# EAGLE design trinket-mcp23017 (EAGLE 9.6.2)
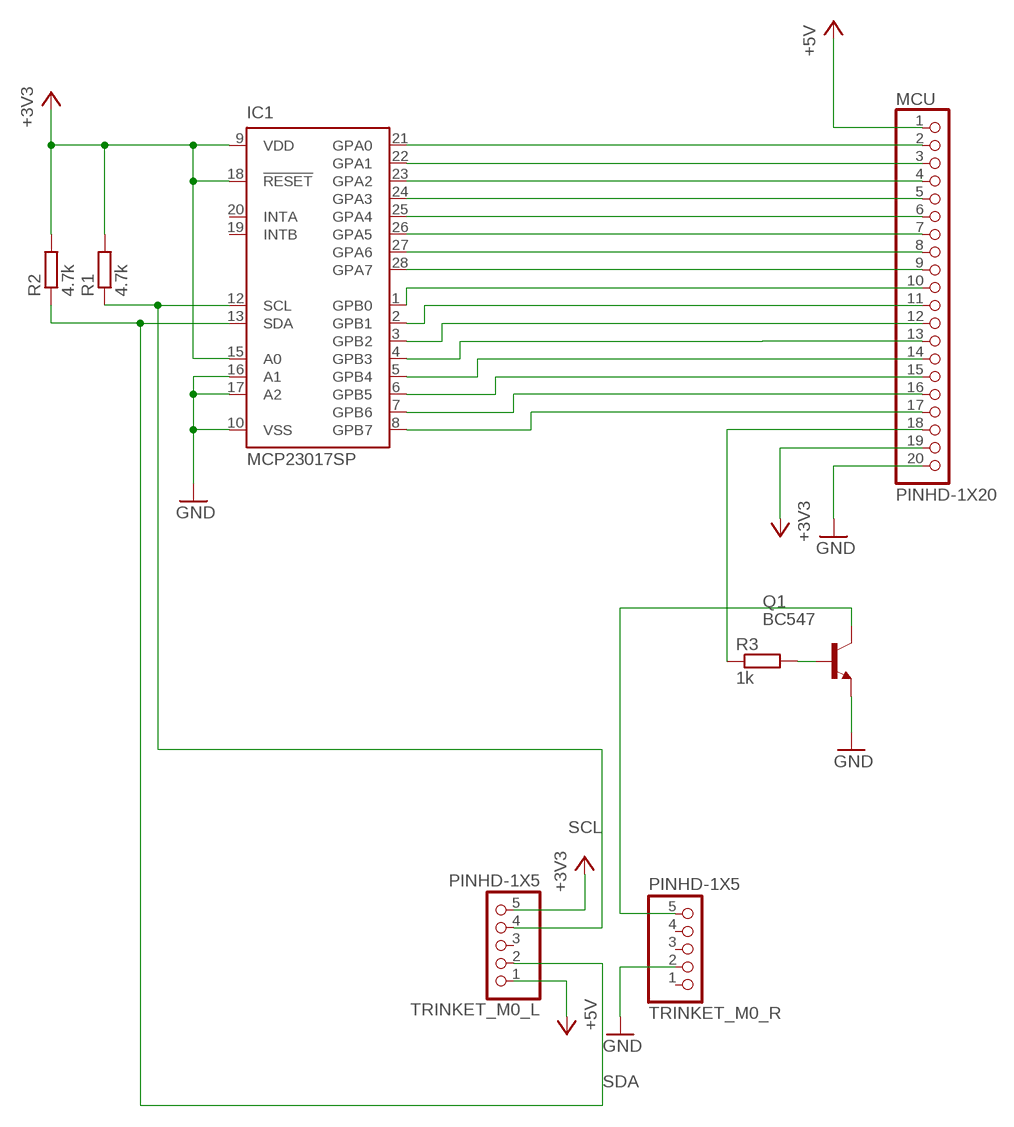
[diagram p0: schematic, sheet 1]

## Parts
IC1  MCP23017SP  [DIL28-3]
MCU  PINHD-1X20  [1X20]
Q1  BC547  [TO92]
R1  4.7k  R-EU_0207/10  [0207/10]
R2  4.7k  R-EU_0207/10  [0207/10]
R3  1k  R-EU_0207/10  [0207/10]
TRINKET_M0_L  PINHD-1X5  [1X05]
TRINKET_M0_R  PINHD-1X5  [1X05]

## Nets
+3V3: IC1.9(VDD) IC1.15(A0) IC1.18(!RESET) MCU.19 R1.2 R2.2 TRINKET_M0_L.5
+5V: MCU.1 TRINKET_M0_L.1
GND: IC1.10(VSS) IC1.16(A1) IC1.17(A2) MCU.20 Q1.1(E) TRINKET_M0_R.2
N$1: IC1.21(GPA0) MCU.2
N$2: IC1.22(GPA1) MCU.3
N$3: IC1.23(GPA2) MCU.4
N$4: IC1.24(GPA3) MCU.5
N$5: IC1.25(GPA4) MCU.6
N$6: IC1.26(GPA5) MCU.7
N$7: IC1.27(GPA6) MCU.8
N$8: IC1.28(GPA7) MCU.9
N$9: IC1.1(GPB0) MCU.10
N$10: IC1.2(GPB1) MCU.11
N$11: IC1.3(GPB2) MCU.12
N$12: IC1.4(GPB3) MCU.13
N$13: IC1.5(GPB4) MCU.14
N$14: IC1.6(GPB5) MCU.15
N$15: IC1.7(GPB6) MCU.16
N$16: IC1.8(GPB7) MCU.17
N$17: Q1.2(B) R3.2
N$18: MCU.18 R3.1
N$19: Q1.3(C) TRINKET_M0_R.5
SCL: IC1.12(SCL) R1.1 TRINKET_M0_L.4
SDA: IC1.13(SDA) R2.1 TRINKET_M0_L.2
Unconnected: IC1.19(INTB) IC1.20(INTA) TRINKET_M0_L.3 TRINKET_M0_R.1 TRINKET_M0_R.3 TRINKET_M0_R.4

## Library data of the parts
IC1 = microchip:MCP23017: http://ww1.microchip.com/downloads/en/DeviceDoc/21952a.pdf Source: http://ww1.microchip.com/downloads/en/DeviceDoc/21952a.pdf; MF: MICROCHIP; MPN: MCP23017-E/SP; OC_FARNELL: 1332088; OC_NEWARK: 31K2959
MCU = Connector:PINHD-1X20: PIN HEADER; CATEGORY: CONNECTOR; SUB-CATEGORY: PIN-HEADER
Q1 = transistor-npn:BC547*: NPN Transistor
R1-R3 = rcl:R-EU_: RESISTOR, European symbol; SPICEPREFIX: R
TRINKET_M0_L TRINKET_M0_R = Connector:PINHD-1X5: PIN HEADER; CATEGORY: CONNECTOR; SUB-CATEGORY: PIN-HEADER

## Board
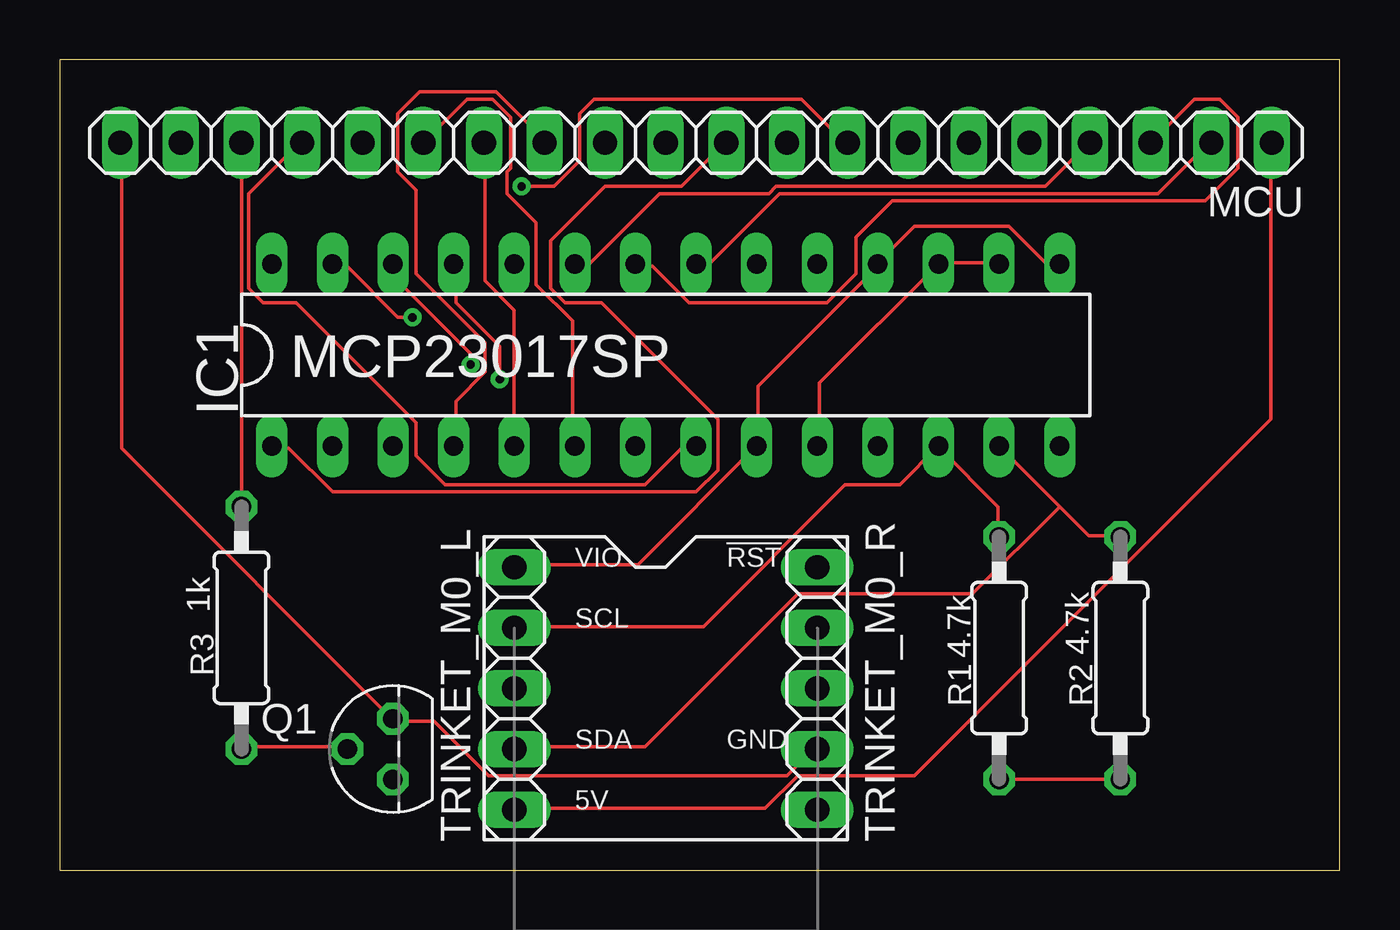
[diagram p1: board, top side]
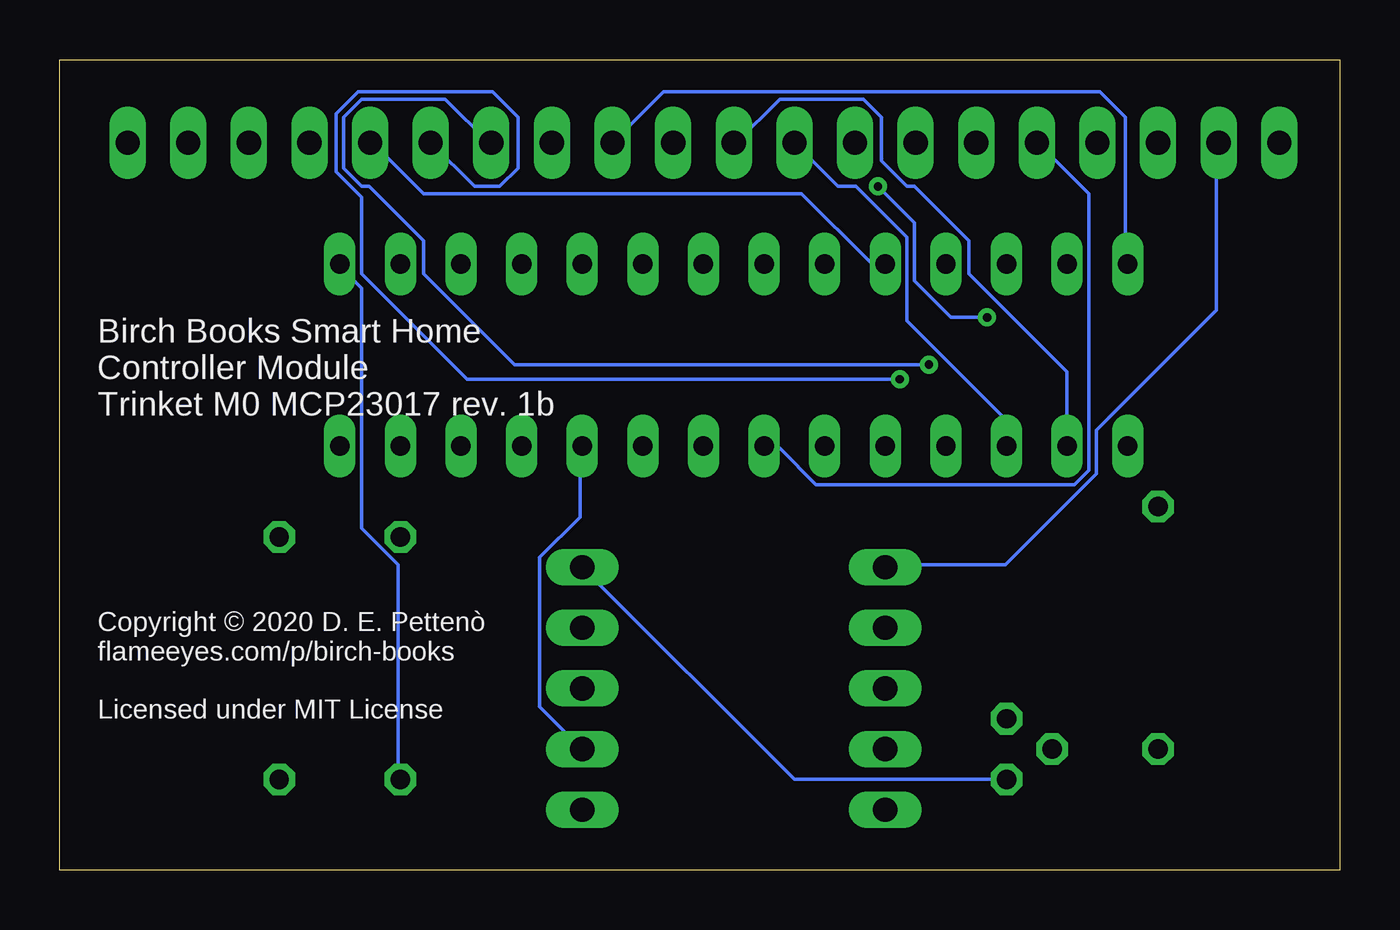
[diagram p2: board, bottom side, seen from below]

Size 53.65 x 33.96 mm. Coordinates in mm from the lower left corner, seen from the top.
Outline: 0,0 53.65,0 53.65,33.96 0,33.96 0,0
Copper layers (1*16): Top 0.035mm / dielectric 1.5mm / Bottom 0.035mm
Design rules "default": minimum track width 6mil, minimum drill 0.35mm, track to track 6mil, track to pad 6mil, pad to pad 6mil, via to via 6mil, smd to smd 6mil, copper to edge 40mil, drill to drill 6mil, minimum pad ring 10mil, minimum via ring 8mil, stop-mask expansion 4mil, vias tented up to drill 0mil, thermal gap 10mil

### Footprints (pad centres in the part's own frame; a part is rotated, then mirrored left to right if it is on the bottom)
DIL28-3 = drill 0.813 long: 1 -16.51,-3.81; 2 -13.97,-3.81; 3 -11.43,-3.81; 4 -8.89,-3.81; 5 -6.35,-3.81; 6 -3.81,-3.81; 7 -1.27,-3.81; 8 1.27,-3.81; 9 3.81,-3.81; 10 6.35,-3.81; 11 8.89,-3.81; 12 11.43,-3.81; 13 13.97,-3.81; 14 16.51,-3.81; 15 16.51,3.81; 16 13.97,3.81; 17 11.43,3.81; 18 8.89,3.81; 19 6.35,3.81; 20 3.81,3.81; 21 1.27,3.81; 22 -1.27,3.81; 23 -3.81,3.81; 24 -6.35,3.81; 25 -8.89,3.81; 26 -11.43,3.81; 27 -13.97,3.81; 28 -16.51,3.81
1X20 = drill 1.016 long: 1 -24.13,0; 2 -21.59,0; 3 -19.05,0; 4 -16.51,0; 5 -13.97,0; 6 -11.43,0; 7 -8.89,0; 8 -6.35,0; 9 -3.81,0; 10 -1.27,0; 11 1.27,0; 12 3.81,0; 13 6.35,0; 14 8.89,0; 15 11.43,0; 16 13.97,0; 17 16.51,0; 18 19.05,0; 19 21.59,0; 20 24.13,0
TO92 = drill 0.813 octagon: 1 1.27,0; 2 0,1.905; 3 -1.27,0
0207/10 = drill 0.813 octagon: 1 -5.08,0; 2 5.08,0
1X05 = drill 1.016 long: 1 -5.08,0; 2 -2.54,0; 3 0,0; 4 2.54,0; 5 5.08,0

### Placement (x,y rotation side)
IC1  25.4,21.59 0 top
MCU  26.67,30.48 180 top
Q1  13.97,5.08 90 top
R1  39.37,8.89 270 top
R2  44.45,8.89 270 top
R3  7.62,10.16 270 top
TRINKET_M0_L  19.05,7.62 90 top
TRINKET_M0_R  31.75,7.62 90 top

### Tracks (layer width: path | path; a pad name or v marks a point on that pad's centre or on a via)
+3V3
  Top 0.152: R2.2 R1.2 | IC1.15 41.91,25.45 41.3,25.45 39.78,26.98 35.81,26.98 34.29,25.45 IC1.18 34.29,25.3 29.26,20.27 29.26,17.83 IC1.9 24.23,12.8 19.05,12.8 TRINKET_M0_L.5
  Bottom 0.152: MCU.19 5.18,30.48 5.18,23.47 10.21,18.44 10.21,16.61 14.02,12.8 19.05,12.8 TRINKET_M0_L.5 | R1.2 39.47,3.81 39.47,12.8 41,14.33 41,24.38 41.91,25.3 IC1.15
+5V
  Top 0.152: TRINKET_M0_L.1 19.05,2.59 29.57,2.59 30.94,3.96 35.81,3.96 50.75,18.9 50.75,30.48 MCU.1
GND
  Top 0.152: IC1.10 31.85,17.83 31.85,20.42 IC1.17 36.88,25.45 39.32,25.45 IC1.16 | TRINKET_M0_R.2 31.7,5.18 30.48,3.96 17.98,3.96 15.7,6.25 14.02,6.25 Q1.1 13.87,6.4 2.59,17.68 2.59,30.48 MCU.20
  Bottom 0.152: TRINKET_M0_R.2 33.53,6.86 33.53,13.11 31.85,14.78 31.85,17.68 IC1.10
N$1
  Top 0.152: IC1.21 26.67,25.45 27.28,25.45 30.18,28.35 46.02,28.35 48.16,30.48 MCU.2
N$2
  Top 0.152: MCU.3 47.55,32.31 48.62,32.31 49.38,31.55 49.38,29.41 48.01,28.04 34.9,28.04 33.38,26.52 33.38,24.99 32.16,23.77 26.36,23.77 24.84,25.3 24.23,25.3 IC1.22
N$3
  Top 0.152: IC1.23 21.64,25.45 22.25,25.45 25.15,28.35 29.72,28.35 30.02,28.65 41.3,28.65 43.13,30.48 MCU.4
N$4
  Bottom 0.152: IC1.24 19.05,25.45 19.66,25.45 22.55,28.35 38.41,28.35 40.54,30.48 MCU.5
N$5  (via drill 0.35)
  Top 0.152: v18.44,20.57 18.44,21.95 16.61,23.77 16.61,25.3 IC1.25
  Bottom 0.152: v18.44,20.57 36.58,20.57 41,24.99 41,28.19 42.06,29.26 42.06,31.7 41.15,32.61 35.51,32.61 34.44,31.55 34.44,29.41 35.2,28.65 36.27,28.65 MCU.6
N$6  (via drill 0.35)
  Top 0.152: v17.22,21.18 17.22,21.64 14.02,24.84 14.02,25.3 IC1.26
  Bottom 0.152: v17.22,21.18 34.59,21.18 38.41,24.99 38.41,26.36 40.69,28.65 41,28.65 41.76,29.41 41.76,31.55 41,32.31 37.49,32.31 35.66,30.48 MCU.7
N$7  (via drill 0.35)
  Top 0.152: v14.78,23.16 14.17,23.16 12.04,25.3 11.43,25.3 IC1.27 | v19.36,28.65 20.73,28.65 21.79,29.72 21.79,31.7 22.4,32.31 31.09,32.31 32.92,30.48 MCU.8
  Bottom 0.152: v14.78,23.16 16.31,23.16 17.83,24.69 17.83,27.13 v19.36,28.65
N$8
  Bottom 0.152: MCU.9 28.35,32.61 10.06,32.61 8.99,31.55 8.99,25.45 IC1.28
N$9
  Top 0.152: IC1.1 8.99,17.68 9.6,17.68 11.43,15.85 26.67,15.85 27.58,16.76 27.58,18.9 22.71,23.77 21.18,23.77 20.57,24.38 20.57,26.36 22.86,28.65 26.06,28.65 27.89,30.48 MCU.10
N$10
  Bottom 0.152: IC1.2 11.43,20.88 15.54,24.99 15.54,26.36 17.83,28.65 18.14,28.65 19.2,29.72 19.2,31.55 19.96,32.31 23.47,32.31 25.3,30.48 MCU.11
N$11
  Bottom 0.152: MCU.12 21.03,28.65 20.27,28.65 18.14,26.52 18.14,23.01 14.02,18.9 14.02,17.83 IC1.3
N$12
  Top 0.152: IC1.4 16.61,17.83 16.61,19.66 17.83,20.88 17.83,22.1 14.94,24.99 14.94,28.5 14.17,29.26 14.17,31.7 15.09,32.61 18.29,32.61 20.42,30.48 MCU.13
N$13
  Top 0.152: IC1.5 19.05,23.47 17.83,24.69 17.83,30.48 MCU.14
N$14
  Top 0.152: MCU.15 17.07,32.31 18.14,32.31 18.9,31.55 18.9,29.41 18.75,29.26 18.75,28.35 19.96,27.13 19.96,24.54 21.49,23.01 21.49,17.83 IC1.6
N$15
  Bottom 0.152: IC1.7 24.08,17.68 23.47,17.68 21.95,16.15 11.12,16.15 10.52,16.76 10.52,28.35 12.65,30.48 MCU.16
N$16
  Top 0.152: IC1.8 26.67,17.68 26.06,17.68 24.54,16.15 16.15,16.15 14.94,17.37 14.94,18.75 9.91,23.77 8.53,23.77 7.92,24.38 7.92,28.35 10.06,30.48 MCU.17
N$17
  Top 0.152: R3.2 7.62,5.18 12.04,5.18 Q1.2
N$18
  Top 0.152: MCU.18 R3.1
N$19
  Bottom 0.152: Q1.3 22.86,3.81 TRINKET_M0_R.5
SCL
  Top 0.152: R1.1 39.32,14.02 39.32,15.24 36.88,17.68 IC1.12 35.2,16.15 32.92,16.15 26.98,10.21 19.05,10.21 TRINKET_M0_L.4
SDA
  Top 0.152: IC1.13 41.91,15.24 | 41.91,15.24 43.13,14.02 44.35,14.02 R2.1 | 41.91,15.24 38.25,11.58 30.94,11.58 24.54,5.18 19.05,5.18 TRINKET_M0_L.2

### Text on the board
tPlace: VIO | !RST | SCL | SDA | GND | 5V
bPlace: Birch Books Smart Home / Controller Module / Trinket M0 MCP23017 rev. 1b | Copyright © 2020 D. E. Pettenò / flameeyes.com/p/birch-books / / Licensed under MIT License